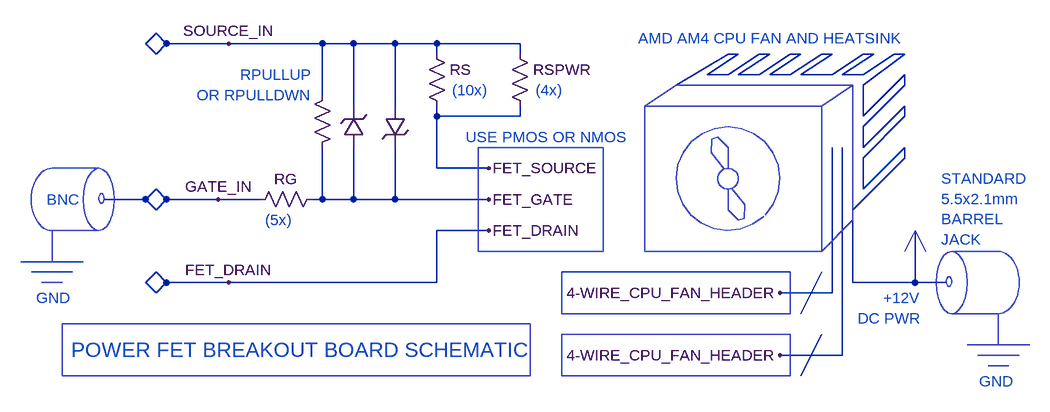
[diagram p0: schematic Sch_for_Documentation.asc]
Sch_for_Documentation.asc, the LTspice schematic file:
Version 4
SHEET 1 1364 680
WIRE -400 -64 -384 -80
WIRE -368 -64 -384 -80
WIRE -272 -64 -368 -64
WIRE -128 -64 -272 -64
WIRE -80 -64 -128 -64
WIRE -16 -64 -80 -64
WIRE 48 -64 -16 -64
WIRE 176 -64 48 -64
WIRE -384 -48 -400 -64
WIRE -384 -48 -368 -64
WIRE 48 -48 48 -64
WIRE 176 -48 176 -64
WIRE 512 -48 496 -48
WIRE 560 -48 544 -48
WIRE 608 -48 592 -48
WIRE 656 -48 640 -48
WIRE 720 -48 704 -48
WIRE 768 -48 752 -48
WIRE 464 -16 512 -48
WIRE 496 -16 544 -48
WIRE 496 -16 464 -16
WIRE 512 -16 560 -48
WIRE 544 -16 592 -48
WIRE 544 -16 512 -16
WIRE 560 -16 608 -48
WIRE 592 -16 640 -48
WIRE 592 -16 560 -16
WIRE 608 -16 656 -48
WIRE 656 -16 704 -48
WIRE 656 -16 608 -16
WIRE 672 -16 720 -48
WIRE 704 -16 752 -48
WIRE 704 -16 672 -16
WIRE 416 0 496 -48
WIRE 704 0 768 -48
WIRE 768 0 768 -16
WIRE -128 16 -128 -64
WIRE -80 32 -80 -64
WIRE -16 32 -16 -64
WIRE 48 48 48 32
WIRE 176 48 176 32
WIRE 176 48 48 48
WIRE 704 48 768 -16
WIRE 704 48 704 0
WIRE 768 48 768 32
WIRE 704 64 768 0
WIRE 704 96 768 32
WIRE 704 96 704 64
WIRE 704 112 768 48
WIRE 768 112 768 96
WIRE 48 128 48 48
WIRE 128 128 48 128
WIRE 704 160 768 96
WIRE 704 160 704 112
WIRE -400 176 -384 160
WIRE -400 176 -464 176
WIRE -368 176 -384 160
WIRE -288 176 -368 176
WIRE -224 176 -288 176
WIRE -128 176 -128 96
WIRE -128 176 -144 176
WIRE -80 176 -80 96
WIRE -80 176 -128 176
WIRE -16 176 -16 96
WIRE -16 176 -80 176
WIRE 128 176 -16 176
WIRE -384 192 -400 176
WIRE -384 192 -368 176
WIRE 688 192 768 112
WIRE 128 224 48 224
WIRE -400 304 -384 288
WIRE -368 304 -384 288
WIRE -272 304 -368 304
WIRE 48 304 48 224
WIRE 48 304 -272 304
WIRE 688 304 688 208
WIRE 784 304 784 224
WIRE 784 304 688 304
WIRE 832 304 784 304
WIRE -384 320 -400 304
WIRE -384 320 -368 304
WIRE 656 320 656 96
WIRE 656 320 576 320
WIRE 608 352 640 288
WIRE 672 416 672 96
WIRE 672 416 576 416
WIRE 608 448 640 384
FLAG 128 128 FET_SOURCE
FLAG 128 176 FET_GATE
FLAG 128 224 FET_DRAIN
FLAG -272 -64 SOURCE_IN
FLAG -288 176 GATE_IN
FLAG -272 304 FET_DRAIN
FLAG 576 320 4-WIRE_CPU_FAN_HEADER
FLAG 576 416 4-WIRE_CPU_FAN_HEADER
SYMBOL res 160 -64 R0
WINDOW 3 36 76 Invisible 2
SYMATTR InstName RSPWR
SYMBOL res 32 -64 R0
WINDOW 3 36 76 Invisible 2
SYMATTR InstName RS
SYMBOL res -240 192 R270
WINDOW 0 32 56 VTop 2
WINDOW 3 0 56 Invisible 2
SYMATTR InstName RG
SYMBOL zener -64 96 R180
WINDOW 0 24 64 Invisible 2
WINDOW 3 24 0 Invisible 2
SYMATTR InstName D1
SYMBOL zener -32 32 R0
WINDOW 0 24 0 Invisible 2
WINDOW 3 24 64 Invisible 2
SYMATTR InstName D2
SYMBOL res -112 0 M0
WINDOW 0 36 40 Invisible 2
WINDOW 3 36 76 Invisible 2
SYMATTR InstName R1
TEXT 72 8 Left 2 ;(10x)
TEXT 200 8 Left 2 ;(4x)
TEXT -216 208 Left 2 ;(5x)
TEXT -144 -16 Right 2 ;RPULLUP\nOR RPULLDWN
TEXT 560 -72 Center 2 ;AMD AM4 CPU FAN AND HEATSINK
TEXT -168 408 Center 3 ;POWER FET BREAKOUT BOARD SCHEMATIC
TEXT -552 176 Left 2 ;BNC
TEXT -568 328 Left 2 ;GND
TEXT 824 144 Left 2 ;STANDARD\n5.5x2.1mm\nBARREL\nJACK
TEXT 936 456 Right 2 ;GND
TEXT 792 328 Right 2 ;+12V\nDC PWR
TEXT 216 80 Center 2 ;USE PMOS OR NMOS
LINE Normal 496 192 496 160
LINE Normal 512 208 496 192
LINE Normal 521 205 512 208
LINE Normal 522 184 521 205
LINE Normal 502 159 522 184
LINE Normal 496 160 502 159 2
LINE Normal 496 160 496 160 2
LINE Normal 496 96 496 128
LINE Normal 480 80 496 96
LINE Normal 471 83 480 80
LINE Normal 470 104 471 83
LINE Normal 490 129 470 104
LINE Normal 496 128 490 129 2
LINE Normal 496 128 496 128 2
LINE Normal 416 0 368 32
LINE Normal 688 0 416 0
LINE Normal 640 32 688 0
LINE Normal 640 32 640 32 2
LINE Normal 688 208 688 0
LINE Normal 640 256 688 208
LINE Normal -544 128 -473 128
LINE Normal -544 224 -473 224
LINE Normal -544 272 -544 224
LINE Normal -496 272 -592 272
LINE Normal -512 288 -576 288
LINE Normal -528 304 -560 304
LINE Normal 912 256 841 256
LINE Normal 912 352 841 352
LINE Normal 912 400 912 352
LINE Normal 864 400 960 400
LINE Normal 880 416 944 416
LINE Normal 896 432 928 432
LINE Normal 784 224 768 256
LINE Normal 784 224 800 256
RECTANGLE Normal 304 256 112 96
RECTANGLE Normal 640 256 368 32
RECTANGLE Normal 240 352 592 288
RECTANGLE Normal 240 448 592 384
RECTANGLE Normal 192 448 -528 368
ARC Normal 416 64 576 224 577 223 536 186
ARC Normal 480 128 512 160 511 150 511 150
ARC Normal -512 224 -576 128 -543 128 -543 224
ARC Normal -496 224 -448 128 -472 128 -472 128
ARC Normal -472 167 -464 182 -472 167 -472 167
ARC Normal 880 352 944 256 911 352 911 256
ARC Normal 864 352 816 256 840 256 840 256
ARC Normal 840 295 832 310 840 295 840 295

The netlist it stands for:
* Sch_for_Documentation.asc
RSPWR SOURCE_IN FET_SOURCE R
RS SOURCE_IN FET_SOURCE R
RG GATE_IN FET_GATE R
D1 FET_GATE SOURCE_IN D
D2 SOURCE_IN FET_GATE D
R1 SOURCE_IN FET_GATE R
.model D D
.lib standard.dio
* (10x)
* (4x)
* (5x)
* RPULLUP
* OR RPULLDWN
* AMD AM4 CPU FAN AND HEATSINK
* POWER FET BREAKOUT BOARD SCHEMATIC
* BNC
* GND
* STANDARD
* 5.5x2.1mm
* BARREL
* JACK
* GND
* +12V
* DC PWR
* USE PMOS OR NMOS
.backanno
.end